# Altium project TPA6120A2 Headphone Amp.PrjPcb
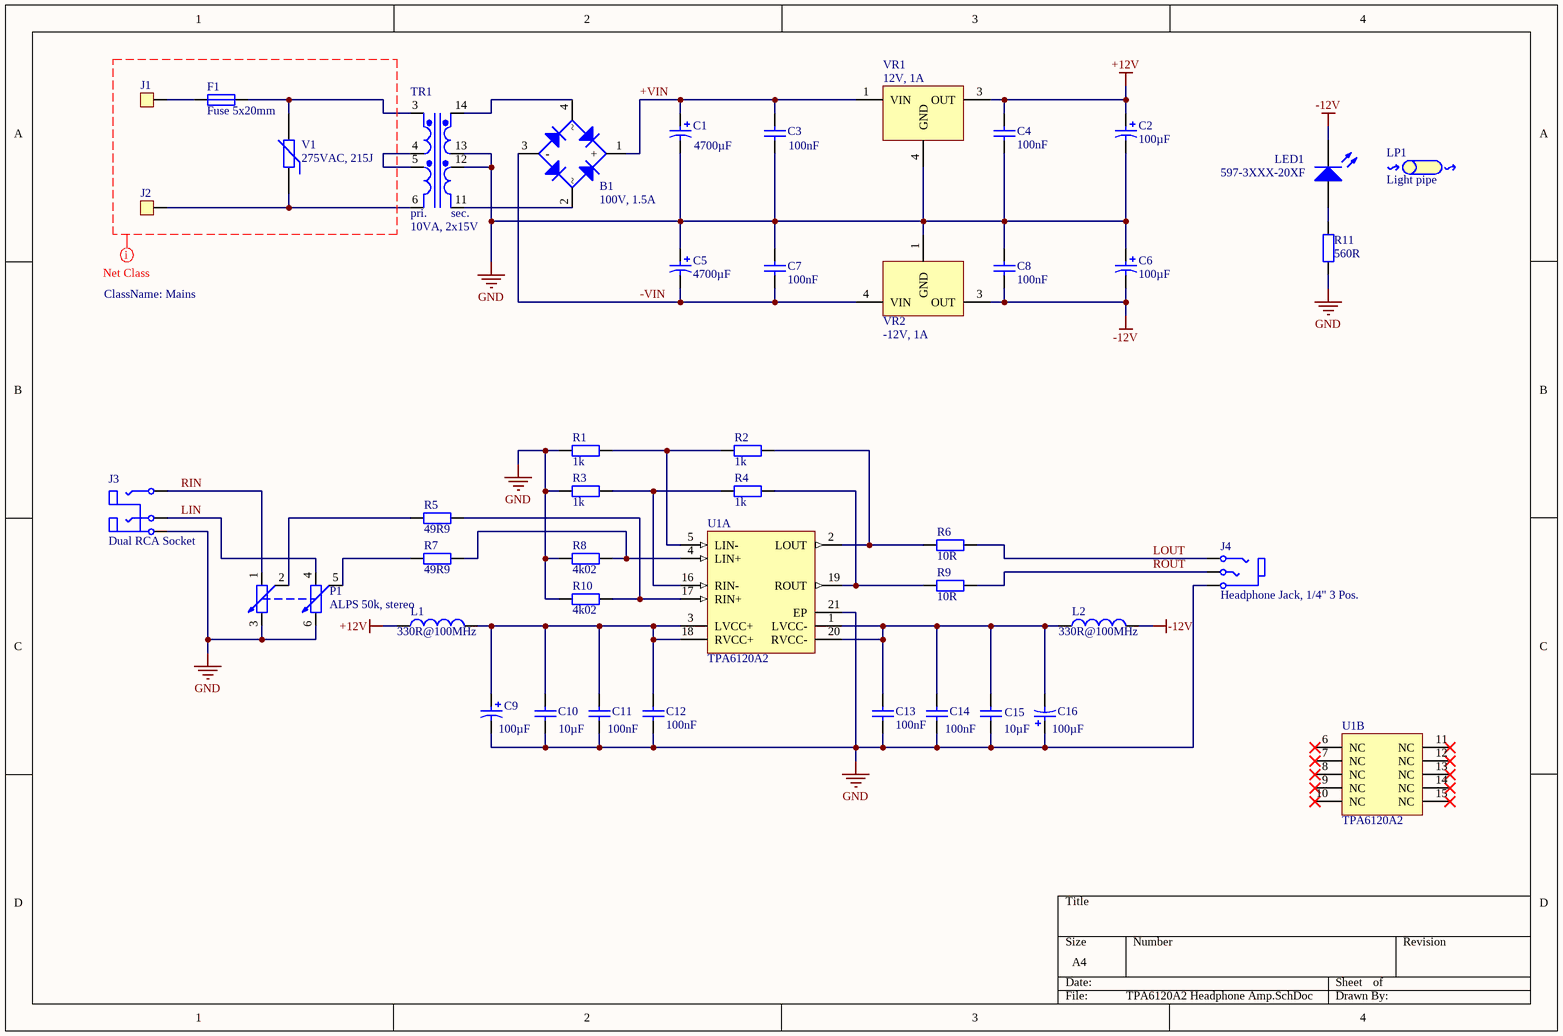
[diagram p0: TPA6120A2 Headphone Amp.SchDoc]
1 sheet, 43 parts. Net scope: global (net labels, ports and power ports of the same name join across sheets).
Board file: TPA6120A2 Headphone Amp.PcbDoc

## Sheet TPA6120A2 Headphone Amp.SchDoc
size A4

### Parts
B1  100V, 1.5A  [WOG]
C1  4700µF  [CAP POL 16x25 RM 7.5MM]
C2  100µF  [cap pol 10x12.5mm rm 5mm]
C3  100nF  [CAP0805_M]
C4  100nF  [CAP0805_M]
C5  4700µF  [CAP POL 16x25 RM 7.5MM]
C6  100µF  [cap pol 10x12.5mm rm 5mm]
C7  100nF  [CAP0805_M]
C8  100nF  [CAP0805_M]
C9  100µF  [cap pol 10x12.5mm rm 5mm]
C10  10µF  [CAP1210_M]
C11  100nF  [CAP0805_M]
C12  100nF  [CAP0805_M]
C13  100nF  [CAP0805_M]
C14  100nF  [CAP0805_M]
C15  10µF  [CAP1210_M]
C16  100µF  [cap pol 10x12.5mm rm 5mm]
F1  Fuse 5x20mm  [0031.8201]
J1  (no value)  [928814-1]
J2  (no value)  [928814-1]
J3  Dual RCA Socket  [PJRAS1X2S__X]
J4  Headphone Jack, 1/4" 3 Pos.  [RA49B]
L1  330R@100MHz  [INDC2012X14N]
L2  330R@100MHz  [INDC2012X14N]
LED1  597-3XXX-20XF  [597-3XXX-20XF]
LP1  Light pipe  [515-1049F]
P1  ALPS 50k, stereo  [ALPS RK27112]
R1  1k  [RES0805_M]
R2  1k  [RES1206_M]
R3  1k  [RES0805_M]
R4  1k  [RES1206_M]
R5  49R9  [RES0805_M]
R6  10R  [RES1206_M]
R7  49R9  [RES0805_M]
R8  4k02  [RES0805_M]
R9  10R  [RES1206_M]
R10  4k02  [RES0805_M]
R11  560R  [RES1206_M]
TR1  10VA, 2x15V  [Talema 10VA]
U1  TPA6120A2  [TI-DWP20-3730X2350TP_N]  (parts A,B of 2)
V1  275VAC, 215J  [S20K275E2]
VR1  12V, 1A  [D2PAK]
VR2  -12V, 1A  [D2PAK]

### Nets
+12V: C2.1 C4.2 L1.1 VR1.3(OUT)
-12V: C6.2 C8.1 L2.2 LED1.2(K) VR2.3(OUT)
GND: C1.2 C2.2 C3.1 C4.1 C5.1 C6.1 C7.2 C8.2 C9.2 C10.1 C11.1 C12.1 C13.1 C14.1 C15.1 C16.1 J3.3 J4.1 P1.3 P1.6 R1.1 R3.1 R8.1 R10.1 R11.2 TR1.12(Sek1-) TR1.13(Sek2+) U1.21(EP) VR1.4(GND) VR2.1(GND)
+VIN: B1.1(+) C1.1 C3.2 VR1.1(VIN)
-VIN: B1.3(-) C5.2 C7.1 VR2.4(VIN)
LIN: J3.1 P1.4
LOUT: J4.2 R6.2
RIN: J3.2 P1.1
ROUT: J4.3 R9.2
NetB1_2: B1.2 TR1.11(Sek1+)
NetB1_4: B1.4 TR1.14(Sek2-)
NetC9_1: C9.1 C10.2 C11.2 C12.2 L1.2 U1.3(LVCC+) U1.18(RVCC+)
NetC13_2: C13.2 C14.2 C15.2 C16.2 L2.1 U1.1(LVCC-) U1.20(RVCC-)
NetF1_1: F1.1 J1.1
NetF1_2: F1.2 TR1.3(Pri2-) V1.2
NetJ2_1: J2.1 TR1.6(Pri1+) V1.1
NetLED1_1: LED1.1(A) R11.1
NetP1_2: P1.2 R5.1
NetP1_5: P1.5 R7.1
NetR1_2: R1.2 R2.2 U1.5(LIN-)
NetR2_1: R2.1 R6.1 U1.2(LOUT)
NetR3_2: R3.2 R4.2 U1.16(RIN-)
NetR4_1: R4.1 R9.1 U1.19(ROUT)
NetR5_2: R5.2 R10.2 U1.17(RIN+)
NetR7_2: R7.2 R8.2 U1.4(LIN+)
NetTR1_4: TR1.4(Pri2+) TR1.5(Pri1-)

Not connected (* = marked no-connect by the designer): U1 6(NC)* 7(NC)* 8(NC)* 9(NC)* 10(NC)* 11(NC)* 12(NC)* 13(NC)* 14(NC)* 15(NC)*

### Layout directives
net class Mains; rule Width Constraint [Pref Width = 30mil    Min Width = 20mil    Max Width = 50mil]; rule Clearance Constraint [Clearance = 98.425mil]: (no net found under the mark)

### Notes on the sheet
- (in symbol Talema 70043k) pri.; sec.

### Library data of the parts
B1 = W01G-E4/51: RECTIFIER BRIDGE 1.5A 100V WOG; Manufacturer: Vishay Semiconductor Diodes Division; Diode Type: Single Phase; Part Number: W01G-E4/51; Value: 100V, 1.5A; Supplier 1: Digi-Key; Supplier Part Number 1: W01G-E4/51GI-ND; Manufacturer Part Number: W01G-E4/51; RoHS: RoHS Compliant; Category: Discrete Semiconductor Products; Stock 1: 6916; Pricing 1: 1=0.61, 10=0.538, 100=0.4124, 500=0.32602, 1000=0.26082, 2500=0.23636, 5000=0.22006 (EUR); Packaging: Bulk; Voltage - Peak Reverse (Max): 100V; Current - DC Forward (If) (Max): 1.5A; Mounting Type: Through Hole; Package / Case: 4-Circular, WOG; Supplier Device Package: WOG; ComponentLink1URL: http://www.vishay.com/docs/88769/woo5g.pdf; ComponentLink1Description: http://www.vishay.com/docs/88769/woo5g.pdf
C1 C5 = UVY1E472MHD: CAP ALUM 4700UF 20% 25V RADIAL; Manufacturer: Nichicon; Ripple Current: 1.57A; Lifetime @ Temp.: 1000 Hrs @ 105°C; Part Number: UVY1E472MHD; Value: 4700µF; Supplier 1: Digi-Key; Supplier Part Number 1: UVY1E472MHD-ND; Manufacturer Part Number: UVY1E472MHD; RoHS: RoHS Compliant; Category: Capacitors; Stock 1: 286; Pricing 1: 1=1.36, 10=1.076, 25=0.9856, 50=0.932, 100=0.8066, 250=0.71692, 500=0.60936, 1000=0.53768, 2500=0.50183 (EUR); Packaging: Bulk; Capacitance: 4700µF; Tolerance: ±20%; Voltage Rating: 25V; ESR (Equivalent Series Resistance): -; Operating Temperature: -55°C ~ 105°C; Type: -; Applications: General Purpose; Impedance: -; Lead Spacing: 0.295" (7.50mm); Size / Dimension: 0.630" Dia (16.00mm); Height - Seated (Max): 0.984" (25.00mm); Surface Mount Land Size: -; Mounting Type: Through Hole; Package / Case: Radial, Can; ComponentLink1URL: http://nichicon-us.com/english/products/pdfs/e-vy.pdf; ComponentLink1Description: http://nichicon-us.com/english/products/pdfs/e-vy.pdf
C2 C6 C9 C16 = EEU-FC1J101: CAP ALUM 100UF 20% 63V RADIAL; Manufacturer: Panasonic Electronic Components; Ripple Current: 347.8mA; Impedance: 256 mOhm; Lifetime @ Temp.: 3000 Hrs @ 105°C; Part Number: EEU-FC1J101; Value: 100µF; Supplier 1: Digi-Key; Supplier Part Number 1: P10343-ND; Manufacturer Part Number: EEU-FC1J101; RoHS: RoHS Compliant; Category: Capacitors; Stock 1: 36939; Pricing 1: 1=0.51, 50=0.2742, 100=0.2388, 500=0.17686, 1000=0.15034, 5000=0.13265, 10000=0.12381, 25000=0.11939 (EUR); Packaging: Bulk; Capacitance: 100µF; Tolerance: ±20%; Voltage Rating: 63V; ESR (Equivalent Series Resistance): -; Operating Temperature: -55°C ~ 105°C; Type: -; Applications: AEC-Q200; Lead Spacing: 0.197" (5.00mm); Size / Dimension: 0.394" Dia (10.00mm); Height - Seated (Max): 0.492" (12.50mm); Surface Mount Land Size: -; Mounting Type: Through Hole; Package / Case: Radial, Can; ComponentLink1URL: http://industrial.panasonic.com/www-cgi/jvcr13pz.cgi?E+PZ+3+ABA0022+EEUFC1J101+7+WW; ComponentLink1Description: http://industrial.panasonic.com/www-cgi/jvcr13pz.cgi?E+PZ+3+ABA0022+EEUFC1J101+7+WW
C3 C4 C7 C8 C11-C14 = C0805C104K5RACTU: CAP CER 0.1UF 50V 10% X7R 0805; Manufacturer: Kemet; Capacitance: 0.1µF; Part Number: C0805C104K5RACTU; Value: 100nF; Supplier 1: Digi-Key; Supplier Part Number 1: 399-1170-1-ND; Manufacturer Part Number: C0805C104K5RACTU; RoHS: RoHS Compliant; Category: Capacitors; Stock 1: 3780914; Pricing 1: 1=0.1, 10=0.048, 25=0.034, 50=0.026, 100=0.0219, 250=0.018, 1000=0.01176 (EUR); Packaging: Cut Tape (CT); Tolerance: ±10%; Voltage - Rated: 50V; Temperature Coefficient: X7R; Mounting Type: Surface Mount, MLCC; Operating Temperature: -55°C ~ 125°C; Applications: General Purpose; Ratings: -; Package / Case: 0805 (2012 Metric); Size / Dimension: 0.079" L x 0.049" W (2.00mm x 1.25mm); Height - Seated (Max): -; Thickness (Max): 0.035" (0.88mm); Lead Spacing: -; Features: -; Lead Style: -; ComponentLink1URL: http://www.kemet.com/docfinder?Partnumber=C0805C104K5RACTU; ComponentLink1Description: http://www.kemet.com/docfinder?Partnumber=C0805C104K5RACTU
C10 C15 = C1210C106K5RACTU: CAP CER 10UF 50V X7R 1210; Manufacturer: Kemet; Tolerance: ±10%; Part Number: C1210C106K5RACTU; Value: 10µF; Supplier 1: Digi-Key; Supplier Part Number 1: 399-11629-1-ND; Manufacturer Part Number: C1210C106K5RACTU; RoHS: RoHS Compliant; Category: Capacitors; Stock 1: 5886; Pricing 1: 1=1.11, 10=0.931, 50=0.7524, 100=0.594, 250=0.49496, 500=0.44548 (EUR); Packaging: Cut Tape (CT); Capacitance: 10µF; Voltage - Rated: 50V; Temperature Coefficient: X7R; Mounting Type: Surface Mount, MLCC; Operating Temperature: -55°C ~ 125°C; Applications: General Purpose; Ratings: -; Package / Case: 1210 (3225 Metric); Size / Dimension: 0.126" L x 0.098" W (3.20mm x 2.50mm); Height - Seated (Max): -; Thickness (Max): 0.110" (2.80mm); Lead Spacing: -; Features: -; Lead Style: -; ComponentLink1URL: http://www.kemet.com/Lists/ProductCatalog/Attachments/53/KEM_C1002_X7R_SMD.pdf; ComponentLink1Description: http://www.kemet.com/Lists/ProductCatalog/Attachments/53/KEM_C1002_X7R_SMD.pdf
F1 = 0031.8201: FUSE BLOK CARTRIDGE 500V 10A PCB; Manufacturer: Schurter Inc.; Fuseholder Type: Block; For Use With/Related Products: 5mm x 20mm; Number of Circuits: 1; Part Number: 0031.8201; Value: Fuse 5x20mm; Supplier 1: Digi-Key; Supplier Part Number 1: 486-1258-ND; Manufacturer Part Number: 0031.8201; RoHS: RoHS Compliant; Category: Circuit Protection; Stock 1: 13443; Pricing 1: 1=0.81, 25=0.7072, 50=0.6034, 100=0.5431, 250=0.47704, 500=0.41012, 1000=0.35506 (EUR); Fuse Type: Cartridge; Fuse Size: 5mm x 20mm; Voltage: 500V; Current Rating: 10A; Mounting Type: PCB; Orientation: Horizontal; Termination Style: PC Pin; Contact Material: Copper Alloy; Contact Finish: Tin; ComponentLink1URL: http://www.schurterinc.com/var/schurter/storage/ilcatalogue/files/document/datasheet/en/pdf/typ_OGN.pdf; ComponentLink1Description: http://www.schurterinc.com/var/schurter/storage/ilcatalogue/files/document/datasheet/en/pdf/typ_OGN.pdf
J1 J2 = 928814-1: CONN QC TAB 0.250 SOLDER; Manufacturer: TE Connectivity AMP Connectors; Gender: Male; Tab Width: 0.250" (6.35mm); Tab Thickness: 0.032" (0.81mm); Tab Length: 0.358" (9.09mm); Insulation: Non-Insulated; Part Number: 928814-1; Supplier 1: Digi-Key; Supplier Part Number 1: A106570-ND; Manufacturer Part Number: 928814-1; RoHS: RoHS Compliant; Category: Connectors, Interconnects; Stock 1: 9054; Pricing 1: 1=0.25, 100=0.1631, 500=0.1565, 1000=0.13011, 2000=0.1188, 5000=0.11502, 10000=0.10371, 25000=0.09315 (EUR); Packaging: Bulk; Mounting Type: Through Hole, Right Angle; Termination: Solder; Features: -; Contact Finish: Tin; Color: -; ComponentLink1URL: http://www.te.com/commerce/DocumentDelivery/DDEController?Action=srchrtrv&DocNm=928814&DocType=Customer+Drawing&DocLang=English; ComponentLink1Description: http://www.te.com/commerce/DocumentDelivery/DDEController?Action=srchrtrv&DocNm=928814&DocType=Customer+Drawing&DocLang=English; Wire Gauge: -; Contact Material: Brass; Terminal Type: Standard; Length - Overall: -; Insulation Diameter: -
J3 = PJRAS1X2S01X: PHONO JACK 2POS R/A RED/WHT; Manufacturer: Switchcraft Inc.; Connector Type: Phono (RCA) Jack; Gender: Female; Signal Lines: Mono; Plug/Mating Plug Diameter: 3.20mm ID, 9.00mm OD (RCA); Number of Positions/Contacts: 2 Sets of 2 Conductors, 3 Contacts; Internal Switch(s): Does Not Contain Switch; Shielding: Shielded; Color - Contact: Red, White; Voltage - Rated: 34VAC/DC; Current Rating: 2A; Part Number: PJRAS1X2S01X; Value: Dual RCA Socket; Supplier 1: Digi-Key; Supplier Part Number 1: SC1857-ND; Manufacturer Part Number: PJRAS1X2S01X; RoHS: RoHS Compliant; Category: Connectors, Interconnects; Stock 1: 2378; Pricing 1: 1=1.45, 10=1.317, 25=1.236, 100=1.1285, 250=1.02104, 500=0.94044, 1000=0.80609, 2500=0.75236, 5000=0.71474 (EUR); Packaging: -; Mounting Type: Through Hole, Right Angle; Termination: Solder; Features: Grounding Tab; ComponentLink1URL: http://www.switchcraft.com/Drawings/pjras1x2s__x_series_cd.pdf; ComponentLink1Description: http://www.switchcraft.com/Drawings/pjras1x2s__x_series_cd.pdf; Contact Material: Copper Alloy; Contact Material - Plating: Tin; Housing Material: Thermoplastic; Housing Color: Black; Operating Temperature: -25°C ~ 85°C
J4 = RA49B12B: CONN JACK R/A 3-COND DBL OPEN; Manufacturer: Switchcraft Inc.; Gender: Female; Signal Lines: Stereo; Plug/Mating Plug Diameter: 6.35mm (0.250", 1/4") - Headphone; Number of Positions/Contacts: 3 Conductors, 3 Contacts; Internal Switch(s): Does Not Contain Switch; Shielding: Unshielded; Color - Contact: Black; Part Number: RA49B12B; Value: Headphone Jack, 1/4" 3 Pos.; Supplier 1: Digi-Key; Supplier Part Number 1: SC1535-ND; Manufacturer Part Number: RA49B12B; RoHS: RoHS Compliant; Category: Connectors, Interconnects; Stock 1: 443; Pricing 1: 1=3.26, 10=2.448, 25=2.2432, 100=2.0393, 250=1.83536, 500=1.55374, 1000=1.4275 (EUR); Packaging: -; Connector Type: Phone Jack; Mounting Type: Through Hole, Right Angle; Termination: Solder; Features: -; ComponentLink1URL: http://www.switchcraft.com/Drawings/ra49b_Series_cd.pdf; ComponentLink1Description: http://www.switchcraft.com/Drawings/ra49b_Series_cd.pdf; Contact Material: Copper Alloy; Contact Material - Plating: Silver; Housing Material: Thermoplastic; Housing Color: Black; Operating Temperature: -; Voltage - Rated: -; Current Rating: -
L1 L2 = MPZ2012S331AT000: FERRITE CHIP 330 OHM 2.5A 0805; Manufacturer: TDK Corporation; Impedance @ Frequency: 330 Ohm @ 100MHz; DC Resistance (DCR): 50 mOhm Max; Filter Type: Differential Mode - Single; Part Number: MPZ2012S331AT000; Value: 330R@100MHz; Supplier 1: Digi-Key; Supplier Part Number 1: 445-1569-1-ND; Manufacturer Part Number: MPZ2012S331AT000; RoHS: RoHS Compliant; Category: Filters; Stock 1: 333862; Pricing 1: 1=0.11, 10=0.095, 100=0.0541, 250=0.04268, 500=0.03606, 1000=0.03037 (EUR); Packaging: Cut Tape (CT); Current Rating: 2.5A; Package / Case: 0805 (2012 Metric); Mounting Type: Surface Mount; Height (Max): 0.041" (1.05mm); Size / Dimension: 0.079" L x 0.049" W (2.00mm x 1.25mm); ComponentLink1URL: https://product.tdk.com/info/en/catalog/datasheets/beads_commercial_power_mpz2012_en.pdf; ComponentLink1Description: https://product.tdk.com/info/en/catalog/datasheets/beads_commercial_power_mpz2012_en.pdf
LED1 = 597-3001-202F: LED RED CLEAR 2PLCC SMD; Manufacturer: Dialight; Manufacturer Part Number: 5973001202F; Voltage - Forward (Vf) (Typ): 2V; Viewing Angle: 120°; Wavelength - Peak: 630nm; Millicandela Rating: 10mcd; Current - Test: 10mA; Lens Color: Colorless; Lens Style/Size: Round with Flat Top; Part Number: 597-3001-202F; Value: 597-3XXX-20XF; Supplier 1: Digi-Key; Supplier Part Number 1: 350-2878-ND; RoHS: RoHS Compliant; Category: Optoelectronics; Stock 1: 1; Pricing 1: 1=0.78, 10=0.601, 100=0.4295, 250=0.378, 500=0.32644, 1000=0.25772, 2500=0.24255 (EUR); Packaging: Cut Strip; Mounting Type: Surface Mount; Package / Case: 2-PLCC; ComponentLink1URL: http://www.dialight.com/Assets/Drawings/2D_Drawings_DrawingDetailedSpec/C17292.pdf; ComponentLink1Description: http://www.dialight.com/Assets/Drawings/2D_Drawings_DrawingDetailedSpec/C17292.pdf; Supplier Device Package: 2-PLCC; Color: Red; Wavelength - Dominant: -; Lens Transparency: Clear; Size / Dimension: 3.20mm L x 2.80mm W; Height (Max): 1.90mm; Features: -
LP1 = 5151049F: LIGHT PIPE SGL ELEMENT; Manufacturer: Dialight; Lens Style/Size: Round with Flat Top, 3.5mm; Configuration: Single; Part Number: 5151049F; Value: Light pipe; Supplier 1: Digi-Key; Supplier Part Number 1: 350-2175-ND; Manufacturer Part Number: 5151049F; RoHS: RoHS Compliant; Category: Optoelectronics; Stock 1: 3701; Pricing 1: 1=1.41, 10=1.148, 25=0.8828, 100=0.7943, 250=0.70608, 500=0.60016, 1000=0.49425, 2500=0.46954, 5000=0.45895 (EUR); Type: Rigid; Mounting Type: Board Mount, Press Fit, Right Angle; ComponentLink1URL: http://www.dialight.com/Assets/Drawings/2D_Drawings_DrawingDetailedSpec/C16134.pdf; ComponentLink1Description: http://www.dialight.com/Assets/Drawings/2D_Drawings_DrawingDetailedSpec/C16134.pdf; Color: Clear
P1 = ALPS RK27112-F25-C0-A203: Pot, Stereo; Part Number: ALPS RK27112-F25-C0-A203; Value: ALPS 50k, stereo
R1 R3 = TNPW08051K00BEEA: RES SMD 1K OHM 0.1% 1/8W 0805; Manufacturer: Vishay Dale; Power (Watts): 0.125W, 1/8W; Temperature Coefficient: ±25ppm/°C; Part Number: TNPW08051K00BEEA; Value: 1k; Manufacturer Part Number: TNPW08051K00BEEA; RoHS: RoHS Compliant; Category: Resistors; Stock 1: 6271; Pricing 1: 1=0.7, 10=0.581, 25=0.4976, 50=0.448, 100=0.3899, 250=0.34844, 500=0.28208, 1000=0.22816, 2500=0.22069 (EUR); Packaging: Cut Tape (CT); Resistance (Ohms): 1k; Tolerance: ±0.1%; Composition: Thin Film; Features: Anti-Sulfur, Automotive AEC-Q200, Moisture Resistant; Operating Temperature: -55°C ~ 125°C; Package / Case: 0805 (2012 Metric); Supplier Device Package: 0805; Size / Dimension: 0.079" L x 0.049" W (2.00mm x 1.25mm); Height: 0.022" (0.55mm); Number of Terminations: 2; ComponentLink1URL: http://www.vishay.com/docs/28758/tnpw_e3.pdf; ComponentLink1Description: http://www.vishay.com/docs/28758/tnpw_e3.pdf; Supplier 1: Digi-Key; Supplier Part Number 1: TNP1.00KABCT-ND
R2 R4 = TNPW12061K00BEEA: RES SMD 1K OHM 0.1% 1/4W 1206; Manufacturer: Vishay Dale; Power (Watts): 0.25W, 1/4W; Temperature Coefficient: ±25ppm/°C; Part Number: TNPW12061K00BEEA; Value: 1k; Manufacturer Part Number: TNPW12061K00BEEA; RoHS: RoHS Compliant; Category: Resistors; Stock 1: 2288; Pricing 1: 1=0.91, 10=0.787, 25=0.6916, 50=0.632, 100=0.5486, 250=0.47704, 500=0.39596, 1000=0.32201, 2500=0.31366 (EUR); Packaging: Cut Tape (CT); Resistance (Ohms): 1k; Tolerance: ±0.1%; Composition: Thin Film; Features: Anti-Sulfur, Automotive AEC-Q200, Moisture Resistant; Operating Temperature: -55°C ~ 125°C; Package / Case: 1206 (3216 Metric); Supplier Device Package: 1206; Size / Dimension: 0.126" L x 0.063" W (3.20mm x 1.60mm); Height: 0.026" (0.65mm); Number of Terminations: 2; ComponentLink1URL: http://www.vishay.com/docs/28758/tnpw_e3.pdf; ComponentLink1Description: http://www.vishay.com/docs/28758/tnpw_e3.pdf; Supplier 1: Digi-Key; Supplier Part Number 1: TNP1.00KACCT-ND
R5 R7 = TNPW080549R9BEEA: RES SMD 49.9 OHM 0.1% 1/8W 0805; Manufacturer: Vishay Dale; Resistance (Ohms): 49.9; Power (Watts): 0.125W, 1/8W; Temperature Coefficient: ±25ppm/°C; Part Number: TNPW080549R9BEEA; Value: 49R9; Manufacturer Part Number: TNPW080549R9BEEA; RoHS: RoHS Compliant; Category: Resistors; Stock 1: 10535; Pricing 1: 1=0.7, 10=0.581, 25=0.4976, 50=0.448, 100=0.3899, 250=0.34844, 500=0.28208, 1000=0.22816, 2500=0.22069 (EUR); Packaging: Cut Tape (CT); Tolerance: ±0.1%; Composition: Thin Film; Features: Anti-Sulfur, Automotive AEC-Q200, Moisture Resistant; Operating Temperature: -55°C ~ 125°C; Package / Case: 0805 (2012 Metric); Supplier Device Package: 0805; Size / Dimension: 0.079" L x 0.049" W (2.00mm x 1.25mm); Height: 0.022" (0.55mm); Number of Terminations: 2; ComponentLink1URL: http://www.vishay.com/docs/28758/tnpw_e3.pdf; ComponentLink1Description: http://www.vishay.com/docs/28758/tnpw_e3.pdf; Supplier 1: Digi-Key; Supplier Part Number 1: TNP49.9ABCT-ND
R6 R9 = PAT1206E10R0BST1: RES SMD 10 OHM 0.1% 0.4W 1206; Manufacturer: Vishay Thin Film; Resistance (Ohms): 10; Temperature Coefficient: ±25ppm/°C; Part Number: PAT1206E10R0BST1; Value: 10R; Manufacturer Part Number: PAT1206E10R0BST1; RoHS: RoHS Compliant; Category: Resistors; Stock 1: 15516; Pricing 1: 1=0.98, 25=0.798, 50=0.728, 100=0.6301, 250=0.53204, 500=0.44802 (EUR); Packaging: Cut Tape (CT); Tolerance: ±0.1%; Power (Watts): 0.4W; Composition: Thin Film; Features: Anti-Sulfur, Automotive AEC-Q200, Moisture Resistant; Operating Temperature: -55°C ~ 155°C; Package / Case: 1206 (3216 Metric); Supplier Device Package: 1206; Size / Dimension: 0.126" L x 0.063" W (3.20mm x 1.60mm); Height: 0.018" (0.46mm); Number of Terminations: 2; ComponentLink1URL: http://www.vishay.com/docs/60024/pat.pdf; ComponentLink1Description: http://www.vishay.com/docs/60024/pat.pdf; Supplier 1: Digi-Key; Supplier Part Number 1: PAT10.0CCT-ND
R8 R10 = MCU0805MD4021BP100: RES SMD 4.02K OHM 0.1% 1/5W 0805; Manufacturer: Vishay Beyschlag; Power (Watts): 0.2W, 1/5W; Temperature Coefficient: ±25ppm/°C; Part Number: MCU0805MD4021BP100; Value: 4k02; Manufacturer Part Number: MCU0805MD4021BP100; RoHS: RoHS Compliant; Category: Resistors; Stock 1: 2207; Pricing 1: 1=0.77, 10=0.645, 25=0.5528, 50=0.4976, 100=0.4331, 250=0.387, 500=0.3133 (EUR); Packaging: Cut Tape (CT); Resistance (Ohms): 4.02k; Tolerance: ±0.1%; Composition: Thin Film; Features: Anti-Sulfur, Automotive AEC-Q200; Operating Temperature: -55°C ~ 155°C; Package / Case: 0805 (2012 Metric); Supplier Device Package: 0805; Size / Dimension: 0.079" L x 0.049" W (2.00mm x 1.25mm); Height: 0.024" (0.62mm); Number of Terminations: 2; ComponentLink1URL: http://www.vishay.com/docs/28785/mcat_pre.pdf; ComponentLink1Description: http://www.vishay.com/docs/28785/mcat_pre.pdf; Supplier 1: Digi-Key; Supplier Part Number 1: MCU0805-4.02K-MBCT-ND
R11 = CRCW1206560RFKEAHP: RES SMD 560 OHM 1% 1/2W 1206; Manufacturer: Vishay Dale; Resistance (Ohms): 560; Power (Watts): 0.5W, 1/2W; Temperature Coefficient: ±100ppm/°C; Part Number: CRCW1206560RFKEAHP; Value: 560R; Manufacturer Part Number: CRCW1206560RFKEAHP; RoHS: RoHS Compliant; Category: Resistors; Stock 1: 5460; Pricing 1: 1=0.4, 10=0.288, 25=0.2128, 50=0.157, 100=0.1152, 250=0.0952, 500=0.0785, 1000=0.05678, 2500=0.05261 (EUR); Packaging: Cut Tape (CT); Tolerance: ±1%; Composition: Thick Film; Features: Automotive AEC-Q200, Pulse Withstanding; Operating Temperature: -55°C ~ 155°C; Package / Case: 1206 (3216 Metric); Supplier Device Package: 1206 (3216 Metric); Size / Dimension: 0.122" L x 0.063" W (3.10mm x 1.60mm); Height: 0.026" (0.65mm); Number of Terminations: 2; ComponentLink1URL: http://www.vishay.com/docs/20043/crcwhpe3.pdf; ComponentLink1Description: http://www.vishay.com/docs/20043/crcwhpe3.pdf; Supplier 1: Digi-Key; Supplier Part Number 1: 541-560UCT-ND
TR1 = Talema 70043k: XFRMR TOROIDAL 10VA THRU HOLE; Manufacturer: Acme Electric/Amveco/Actown; Manufacturer Part Number: 70043K; Voltage - Primary: 115V, 230V; Voltage - Secondary (Full Load): Parallel 15V, Series 30V; Current - Output (Max): Parallel 666mA, Series 333mA; Primary Winding(s): Dual; Center Tap: No; Voltage - Isolation: 4000Vrms; Part Number: Talema 70043k; Value: 10VA, 2x15V; Supplier 1: Digi-Key; Supplier Part Number 1: TE70043-ND; RoHS: RoHS Compliant; Category: Transformers; Stock 1: 90; Pricing 1: 1=13.61, 10=12.015 (EUR); Type: Toroidal; Secondary Winding(s): Dual; Power - Max: 10 VA; Mounting Type: Through Hole; Termination Style: PC Pin; Size / Dimension: 55.00mm L x 55.00mm W; Height - Seated (Max): 26.00mm; ComponentLink1URL: http://media.digikey.com/pdf/Data%20Sheets/Amveco%20PDFs/70000_Series_Cat.pdf; ComponentLink1Description: http://media.digikey.com/pdf/Data%20Sheets/Amveco%20PDFs/70000_Series_Cat.pdf
U1 = TPA6120A2DWPR: IC AMP AUDIO .08W HIFI 20SOPWR; Manufacturer: Texas Instruments; Output Type: Headphones, 2-Channel (Stereo); Max Output Power x Channels @ Load: 80mW x 2 @ 600 Ohm; Voltage - Supply: 10 V ~ 30 V, ±5 V ~ 15 V; Part Number: TPA6120A2DWPR; Value: TPA6120A2; Supplier 1: Digi-Key; Supplier Part Number 1: 296-39339-1-ND; Manufacturer Part Number: TPA6120A2DWPR; RoHS: RoHS Compliant; Category: Integrated Circuits (ICs); Stock 1: 0; Pricing 1: 1=5.21, 10=4.677, 100=3.8375, 500=3.2647, 1000=2.38646 (EUR); Packaging: Cut Tape (CT); Operating Temperature: -40°C ~ 85°C (TA); Mounting Type: Surface Mount; Package / Case: 20-SOIC (0.295", 7.50mm Width) Exposed Pad; Supplier Device Package: 20-SO PowerPad; ComponentLink1URL: http://www.ti.com/lit/ds/symlink/tpa6120a2.pdf; ComponentLink1Description: http://www.ti.com/lit/ds/symlink/tpa6120a2.pdf; Type: Class AB; Features: Differential Inputs, Short-Circuit and Thermal Protection
V1 = S20K275E2: VARISTOR 387V 10KA DISC 20MM; Manufacturer: EPCOS (TDK); Varistor Voltage (Typ): 430V; Varistor Voltage (Max): 473V; Number of Circuits: 1; Maximum DC Volts: 350VDC; Part Number: S20K275E2; Value: 275VAC, 215J; Supplier 1: Digi-Key; Supplier Part Number 1: 495-1448-ND; Manufacturer Part Number: S20K275E2; RoHS: RoHS Compliant; Category: Circuit Protection; Stock 1: 18461; Pricing 1: 1=0.93, 10=0.828, 100=0.6541, 500=0.5073, 1000=0.4005, 5000=0.35511, 10000=0.34176 (EUR); Packaging: Bulk; Varistor Voltage (Min): 387V; Current - Surge: 10kA; Maximum AC Volts: 275VAC; Energy: 215J; Package / Case: Disc 20mm; Mounting Type: Through Hole; ComponentLink1URL: http://en.tdk.eu/inf/70/db/var_11/SIOV_Leaded_AdvanceD.pdf; ComponentLink1Description: http://en.tdk.eu/inf/70/db/var_11/SIOV_Leaded_AdvanceD.pdf
VR1 = 7812: IC REG LDO 12V 1.5A D2PAK; Part Number: 7812; Manufacturer: STMicroelectronics; Manufacturer Part Number: L7812CD2T-TR; Regulator Topology: Positive Fixed; Voltage - Dropout (Typical): 2V @ 1A; Number of Regulators: 1; Voltage - Input: Up to 35V; Value: 12V, 1A; Supplier 1: Digi-Key; Supplier Part Number 1: 497-1178-1-ND; RoHS: RoHS Compliant; Category: Integrated Circuits (ICs); Stock 1: 6017; Pricing 1: 1=0.59, 10=0.522, 100=0.3996, 500=0.31658 (EUR); Packaging: Cut Tape (CT); Voltage - Output: 12V; Current - Output: 1.5A; Current - Limit (Min): -; Operating Temperature: 0°C ~ 125°C; Mounting Type: Surface Mount; Package / Case: TO-263-3, D²Pak (2 Leads + Tab), TO-263AB; Supplier Device Package: D2PAK; ComponentLink1URL: http://www.st.com/web/en/resource/technical/document/datasheet/CD00000444.pdf; ComponentLink1Description: http://www.st.com/web/en/resource/technical/document/datasheet/CD00000444.pdf
VR2 = 7912: IC REG LDO -12V 1.5A D2PAK; Part Number: 7912; Manufacturer: STMicroelectronics; Manufacturer Part Number: L7912CD2T-TR; Regulator Topology: Negative Fixed; Voltage - Dropout (Typical): 1.1V @ 1A; Number of Regulators: 1; Voltage - Input: Down to -35V; Value: -12V, 1A; Supplier 1: Digi-Key; Supplier Part Number 1: 497-1215-1-ND; RoHS: RoHS Compliant; Category: Integrated Circuits (ICs); Stock 1: 4658; Pricing 1: 1=0.72, 10=0.632, 100=0.4829, 500=0.3826 (EUR); Packaging: Cut Tape (CT); Voltage - Output: -12V; Current - Output: 1.5A; Current - Limit (Min): -; Operating Temperature: 0°C ~ 125°C; Mounting Type: Surface Mount; Package / Case: TO-263-3, D²Pak (2 Leads + Tab), TO-263AB; Supplier Device Package: D2PAK; ComponentLink1URL: http://www.st.com/web/en/resource/technical/document/datasheet/CD00000450.pdf; ComponentLink1Description: http://www.st.com/web/en/resource/technical/document/datasheet/CD00000450.pdf